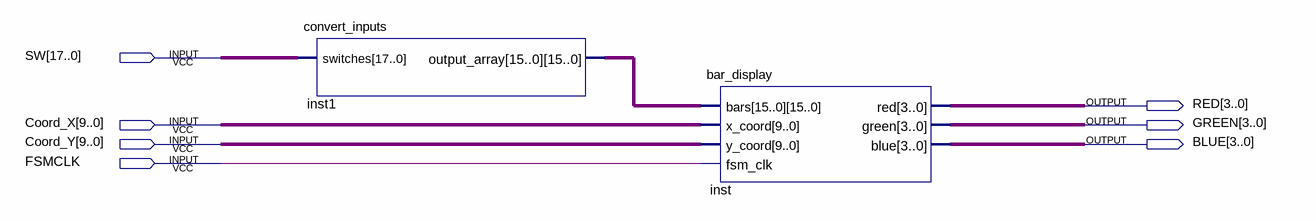
[diagram p0: schematic sheet]
// Quartus schematic video_generator.bdf as structural Verilog: 2 symbols, 7 pins
module video_generator (
  input  [17:0] SW,
  input  [9:0] Coord_X,
  input  [9:0] Coord_Y,
  input  FSMCLK,
  output [3:0] RED,
  output [3:0] GREEN,
  output [3:0] BLUE
);

  wire [255:0] inst1_output_array;

  convert_inputs inst1 (.switches(SW), .output_array(inst1_output_array));
  bar_display inst (
    .bars(inst1_output_array), .x_coord(Coord_X), .y_coord(Coord_Y), .fsm_clk(FSMCLK), .red(RED),
    .green(GREEN), .blue(BLUE));
endmodule
